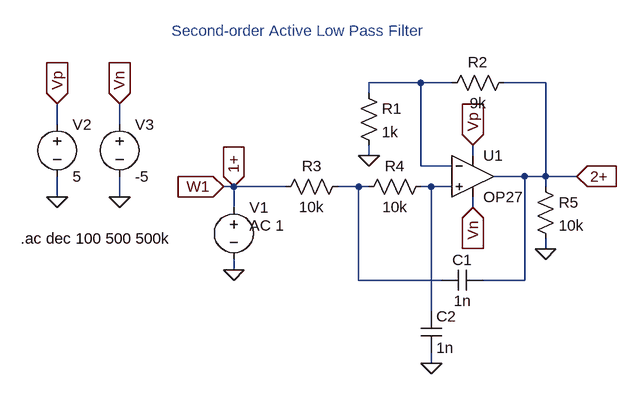
[diagram p0: schematic alpf_gain_2nd.asc]
alpf_gain_2nd.asc, the LTspice schematic file:
Version 4
SHEET 1 880 680
WIRE 464 64 384 64
WIRE 512 64 464 64
WIRE 656 64 592 64
WIRE 384 80 384 64
WIRE -96 128 -96 96
WIRE 0 128 0 96
WIRE 384 176 384 160
WIRE 544 176 544 160
WIRE 464 192 464 64
WIRE 512 192 464 192
WIRE 624 208 576 208
WIRE 656 208 656 64
WIRE 656 208 624 208
WIRE 704 208 656 208
WIRE 176 224 160 224
WIRE 256 224 176 224
WIRE 368 224 336 224
WIRE 384 224 368 224
WIRE 480 224 464 224
WIRE 512 224 480 224
WIRE 656 224 656 208
WIRE -96 240 -96 208
WIRE 0 240 0 208
WIRE 176 256 176 224
WIRE 544 256 544 240
WIRE 656 320 656 304
WIRE 176 352 176 336
WIRE 368 368 368 224
WIRE 496 368 368 368
WIRE 624 368 624 208
WIRE 624 368 560 368
WIRE 480 416 480 224
WIRE 480 496 480 480
FLAG 176 352 0
FLAG -96 240 0
FLAG 0 240 0
FLAG -96 96 Vp
IOPIN -96 96 In
FLAG 0 96 Vn
IOPIN 0 96 In
FLAG 544 160 Vp
IOPIN 544 160 In
FLAG 544 256 Vn
IOPIN 544 256 In
FLAG 656 320 0
FLAG 704 208 2+
IOPIN 704 208 In
FLAG 160 224 W1
IOPIN 160 224 In
FLAG 176 224 1+
IOPIN 176 224 In
FLAG 384 176 0
FLAG 480 496 0
SYMBOL Opamps\\OP27 544 144 R0
SYMATTR InstName U1
SYMBOL voltage 176 240 R0
WINDOW 123 24 44 Left 2
WINDOW 39 0 0 Left 0
SYMATTR Value2 AC 1
SYMATTR InstName V1
SYMATTR Value ""
SYMBOL voltage -96 112 R0
WINDOW 123 0 0 Left 0
WINDOW 39 0 0 Left 0
SYMATTR InstName V2
SYMATTR Value 5
SYMBOL voltage 0 112 R0
WINDOW 123 0 0 Left 0
WINDOW 39 0 0 Left 0
SYMATTR InstName V3
SYMATTR Value -5
SYMBOL res 640 208 R0
SYMATTR InstName R5
SYMATTR Value 10k
SYMBOL res 608 48 R90
WINDOW 0 0 56 VBottom 2
WINDOW 3 32 56 VTop 2
SYMATTR InstName R2
SYMATTR Value 9k
SYMBOL res 352 208 R90
WINDOW 0 0 56 VBottom 2
WINDOW 3 32 56 VTop 2
SYMATTR InstName R3
SYMATTR Value 10k
SYMBOL res 368 64 R0
SYMATTR InstName R1
SYMATTR Value 1k
SYMBOL cap 560 352 R90
WINDOW 0 0 32 VBottom 2
WINDOW 3 32 32 VTop 2
SYMATTR InstName C1
SYMATTR Value 1n
SYMBOL res 480 208 R90
WINDOW 0 0 56 VBottom 2
WINDOW 3 32 56 VTop 2
SYMATTR InstName R4
SYMATTR Value 10k
SYMBOL cap 464 416 R0
SYMATTR InstName C2
SYMATTR Value 1n
TEXT -152 304 Left 2 !.ac dec 100 500 500k
TEXT 80 -16 Left 2 ;Second-order Active Low Pass Filter

The netlist it stands for:
* alpf_gain_2nd.asc
XU1 N003 N001 Vp Vn 2+ OP27  ; pins In+ In- V+ V- OUT
V1 1+ 0 AC 1
V2 Vp 0 5
V3 Vn 0 -5
R5 2+ 0 10k
R2 2+ N001 9k
R3 N002 1+ 10k
R1 N001 0 1k
C1 2+ N002 1n
R4 N003 N002 10k
C2 N003 0 1n
.ac dec 100 500 500k
* Second-order Active Low Pass Filter
.lib ADI.lib
.backanno
.end